# EAGLE design GadgetBox-Propeller (EAGLE 6.6.0)

## Sheet 1 of 2
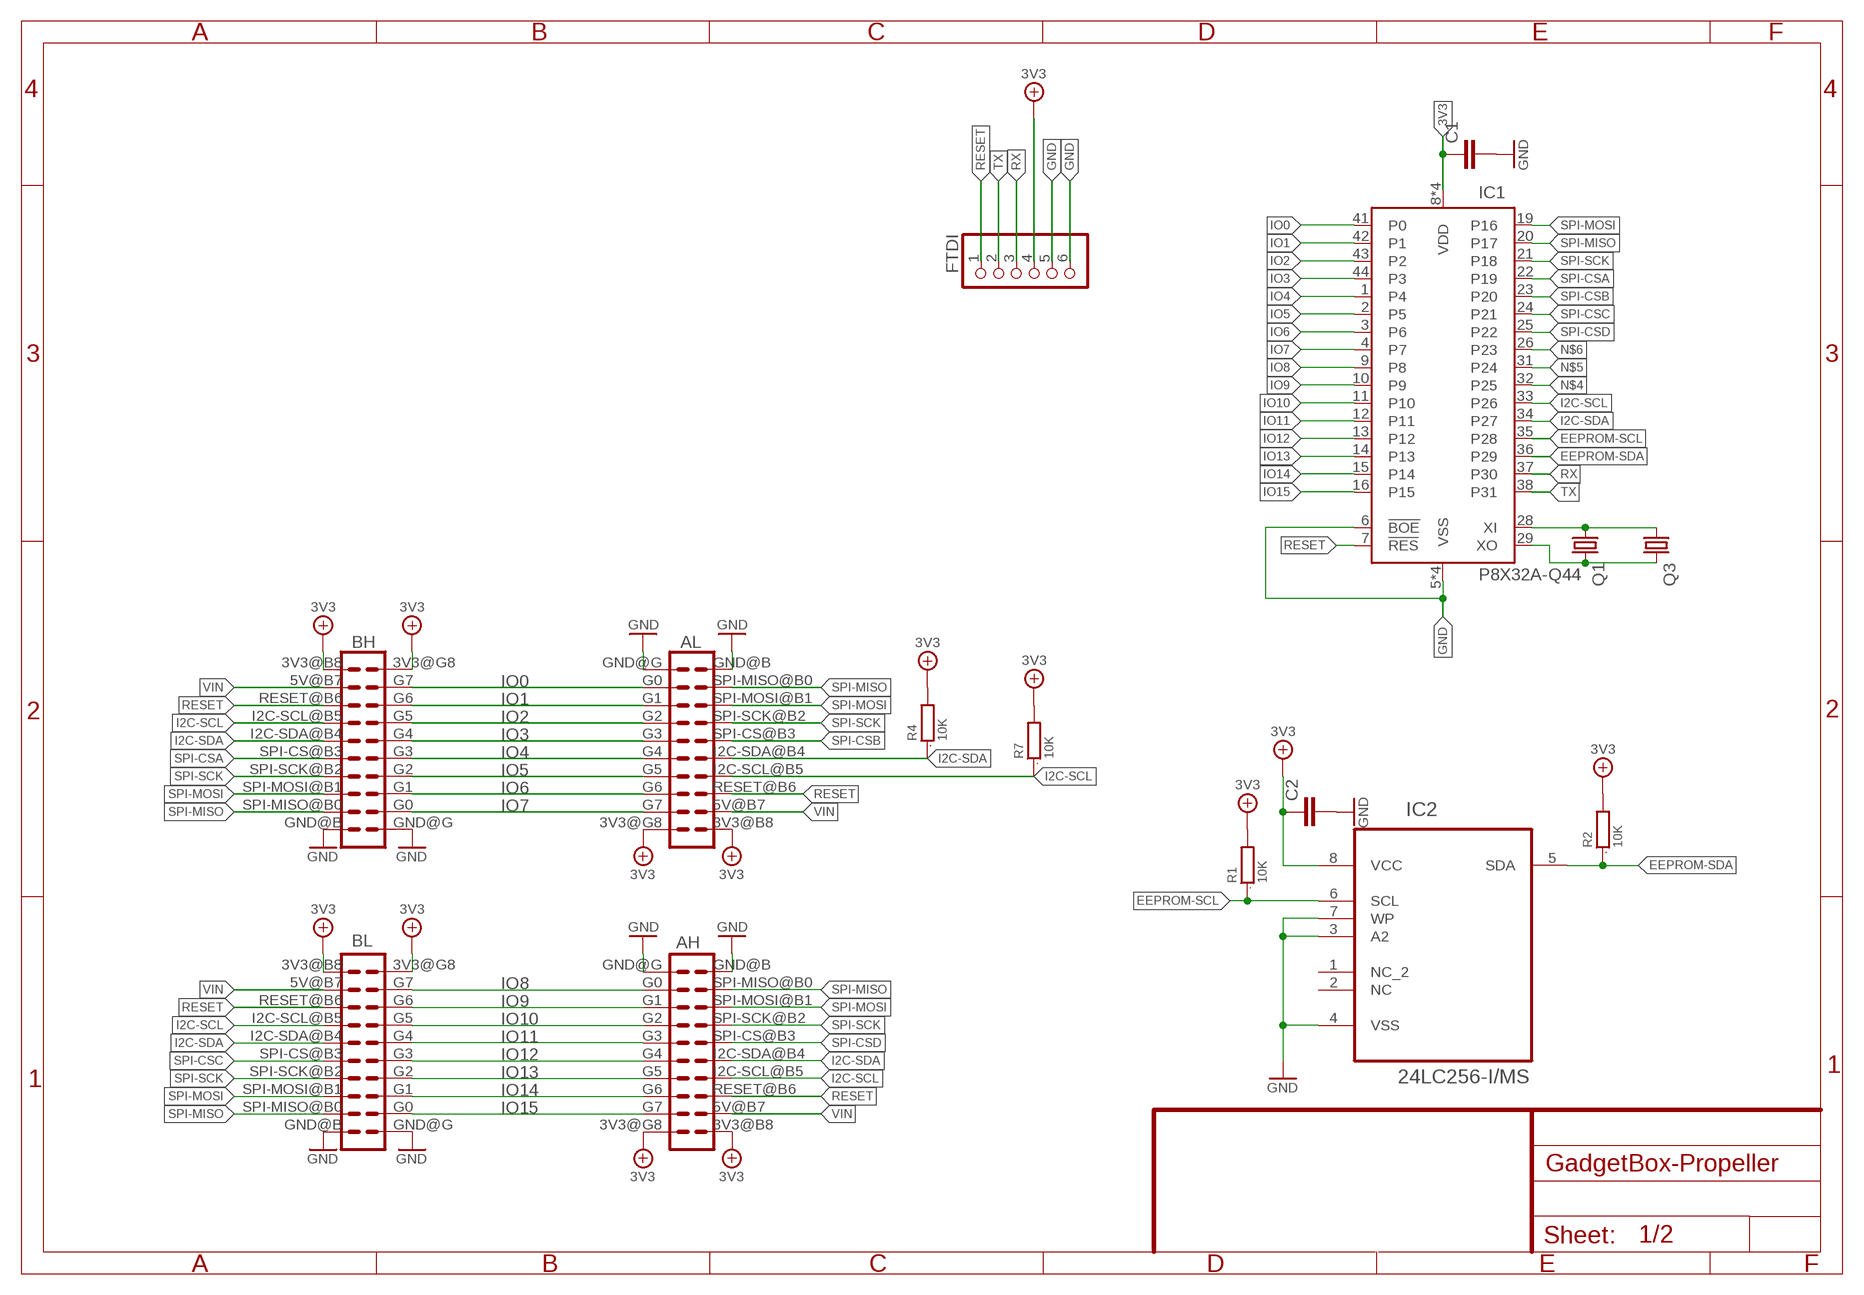
[diagram p0: schematic, sheet 1]

### Parts
AH  ECOGECOG_SLOT_ALT1  [ECOG_ALT1]
AL  ECOGECOG_SLOT_ALT1  [ECOG_ALT1]
BH  ECOGECOG_SLOT_ALT1  [ECOG_ALT1]
BL  ECOGECOG_SLOT_ALT1  [ECOG_ALT1]
C1  CAP0805  [0805]
C2  CAP0805  [0805]
FTDI  PINHD-1X6  [1X06]
IC1  P8X32A-Q44  [LQFP44-10X10]
IC2  24LC256-I/MS  [SOP65P490X110-8N]
Q1  CRYSTALSM49  [SM49]
Q3  CRYSTALHC49U-V  [HC49U-V]
R1  10K  R0603  [0603]
R2  10K  R0603  [0603]
R4  10K  R0603  [0603]
R7  10K  R0603  [0603]

### Nets
3V3: AH.3V3@B8(3V3) AH.3V3@G8(3V3) AL.3V3@B8(3V3) AL.3V3@G8(3V3) BH.3V3@B8(3V3) BH.3V3@G8(3V3) BL.3V3@B8(3V3) BL.3V3@G8(3V3) C1.1 C2.1 FTDI.4 IC1.8(VDD) IC1.18(VDD) IC1.30(VDD) IC1.40(VDD) IC2.8(VCC) R1.2 R2.2 R4.2 R7.2
EEPROM-SCL: IC1.35(P28) IC2.6(SCL) R1.1
EEPROM-SDA: IC1.36(P29) IC2.5(SDA) R2.1
GND [gnd]: AH.GND@B(GND) AH.GND@G(GND) AL.GND@B(GND) AL.GND@G(GND) BH.GND@B(GND) BH.GND@G(GND) BL.GND@B(GND) BL.GND@G(GND) C1.2 C2.2 FTDI.5 FTDI.6 IC1.5(VSS) IC1.6(!BOE) IC1.17(VSS) IC1.27(VSS) IC1.39(VSS) IC2.3(A2) IC2.4(VSS) IC2.7(WP) ; also sheet 2
I2C-SCL: AH.I2C-SCL@B5(I2C-SCL) AL.I2C-SCL@B5(I2C-SCL) BH.I2C-SCL@B5(I2C-SCL) BL.I2C-SCL@B5(I2C-SCL) IC1.33(P26) R7.1
I2C-SDA: AH.I2C-SDA@B4(I2C-SDA) AL.I2C-SDA@B4(I2C-SDA) BH.I2C-SDA@B4(I2C-SDA) BL.I2C-SDA@B4(I2C-SDA) IC1.34(P27) R4.1
IO0: AL.G0 BH.G7 IC1.41(P0)
IO1: AL.G1 BH.G6 IC1.42(P1)
IO2: AL.G2 BH.G5 IC1.43(P2)
IO3: AL.G3 BH.G4 IC1.44(P3)
IO4: AL.G4 BH.G3 IC1.1(P4)
IO5: AL.G5 BH.G2 IC1.2(P5)
IO6: AL.G6 BH.G1 IC1.3(P6)
IO7: AL.G7 BH.G0 IC1.4(P7)
IO8: AH.G0 BL.G7 IC1.9(P8)
IO9: AH.G1 BL.G6 IC1.10(P9)
IO10: AH.G2 BL.G5 IC1.11(P10)
IO11: AH.G3 BL.G4 IC1.12(P11)
IO12: AH.G4 BL.G3 IC1.13(P12)
IO13: AH.G5 BL.G2 IC1.14(P13)
IO14: AH.G6 BL.G1 IC1.15(P14)
IO15: AH.G7 BL.G0 IC1.16(P15)
N$2: IC1.28(XI) Q1.1 Q3.1
N$3: IC1.29(XO) Q1.2 Q3.2
N$4: IC1.32(P25)
N$5: IC1.31(P24)
N$6: IC1.26(P23)
RESET: AH.RESET@B6(RESET) AL.RESET@B6(RESET) BH.RESET@B6(RESET) BL.RESET@B6(RESET) FTDI.1 IC1.7(!RES)
RX: FTDI.3 IC1.37(P30)
SPI-CSA: BH.SPI-CS@B3(SPI-CS) IC1.22(P19)
SPI-CSB: AL.SPI-CS@B3(SPI-CS) IC1.23(P20)
SPI-CSC: BL.SPI-CS@B3(SPI-CS) IC1.24(P21)
SPI-CSD: AH.SPI-CS@B3(SPI-CS) IC1.25(P22)
SPI-MISO: AH.SPI-MISO@B0(SPI-MISO) AL.SPI-MISO@B0(SPI-MISO) BH.SPI-MISO@B0(SPI-MISO) BL.SPI-MISO@B0(SPI-MISO) IC1.20(P17)
SPI-MOSI: AH.SPI-MOSI@B1(SPI-MOSI) AL.SPI-MOSI@B1(SPI-MOSI) BH.SPI-MOSI@B1(SPI-MOSI) BL.SPI-MOSI@B1(SPI-MOSI) IC1.19(P16)
SPI-SCK: AH.SPI-SCK@B2(SPI-SCK) AL.SPI-SCK@B2(SPI-SCK) BH.SPI-SCK@B2(SPI-SCK) BL.SPI-SCK@B2(SPI-SCK) IC1.21(P18)
TX: FTDI.2 IC1.38(P31)
VIN: AH.5V@B7(5V) AL.5V@B7(5V) BH.5V@B7(5V) BL.5V@B7(5V) ; also sheet 2
Unconnected: IC2.1(NC_2) IC2.2(NC)

## Sheet 2 of 2
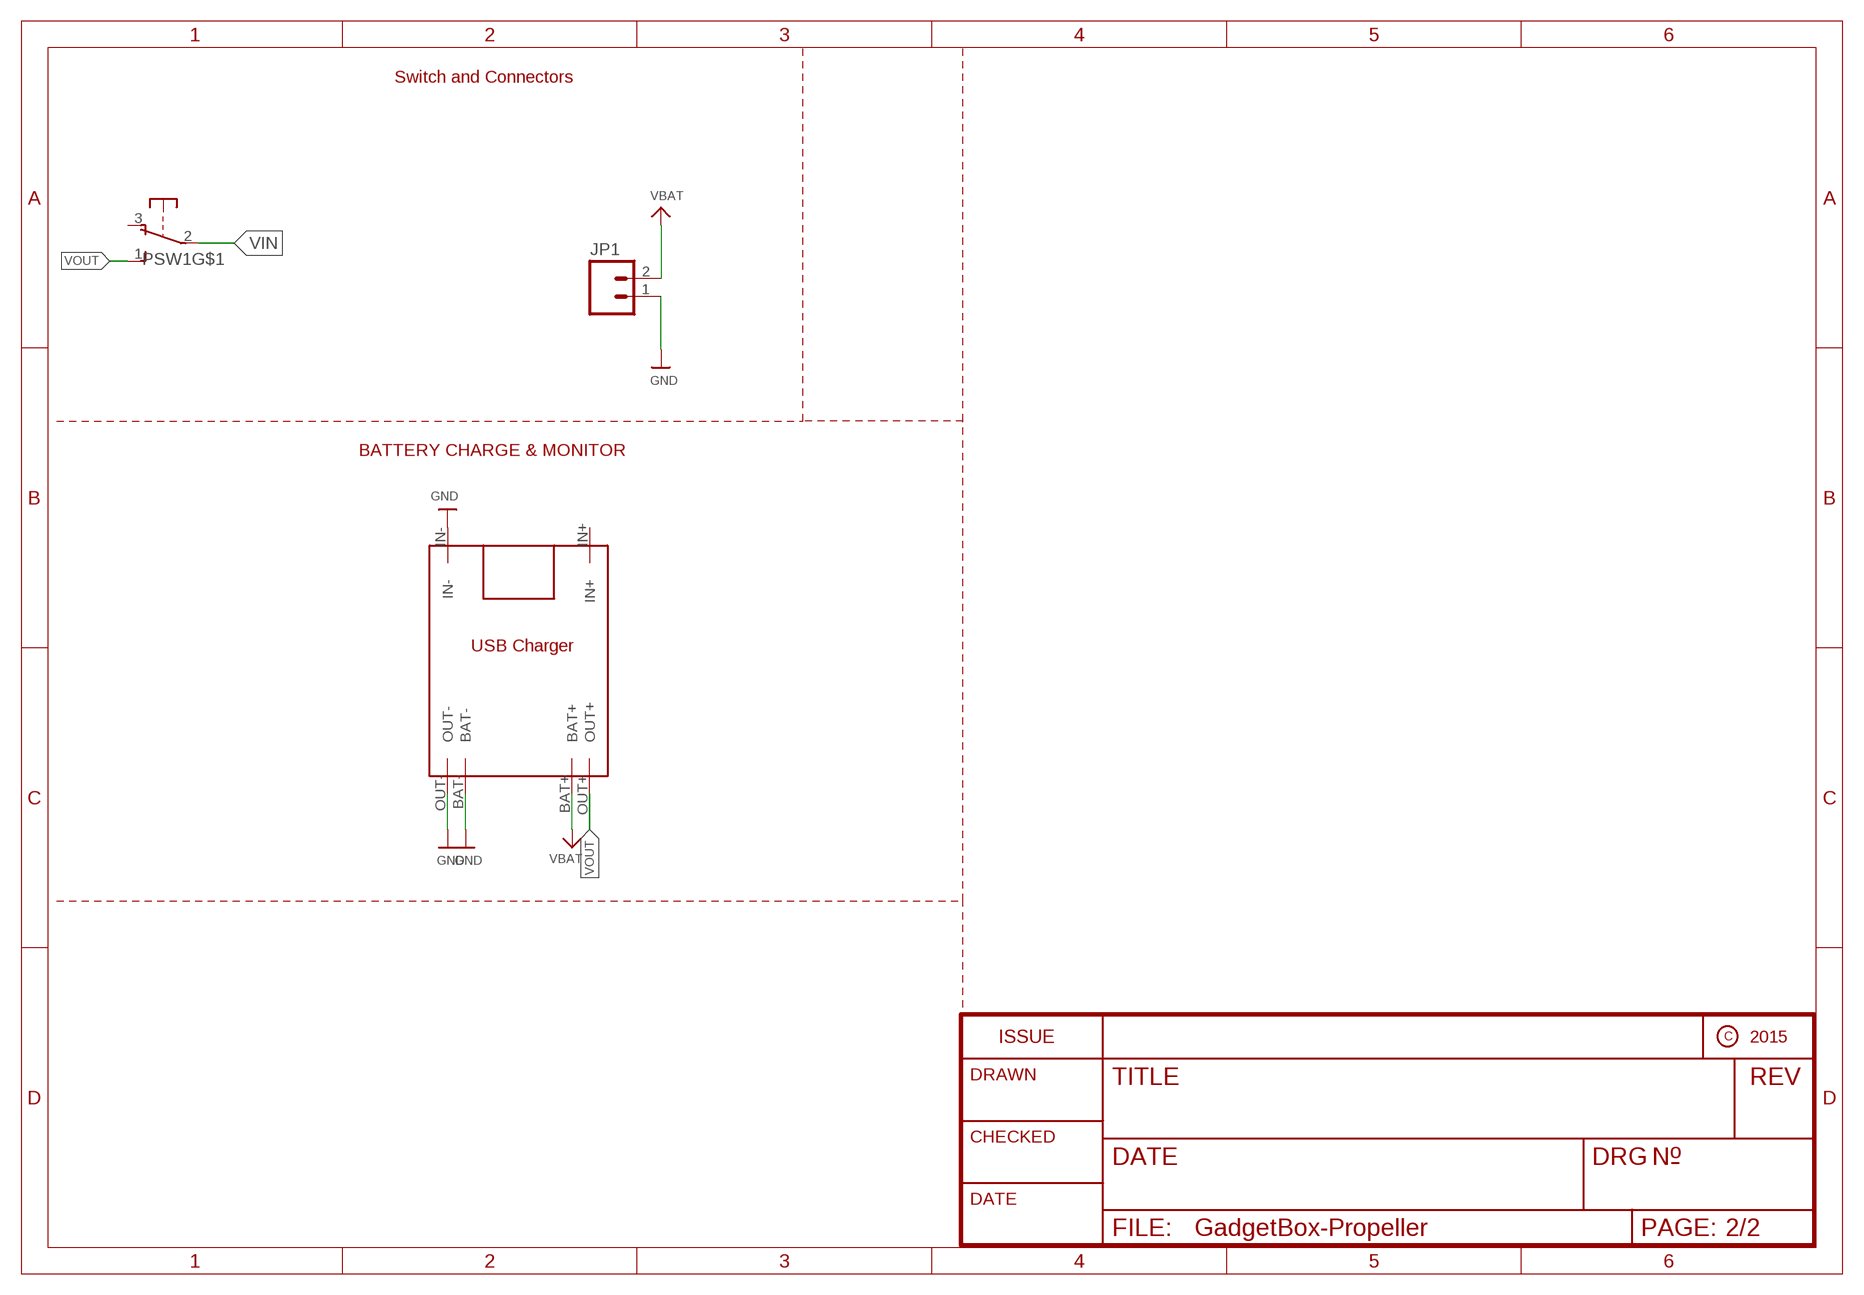
[diagram p1: schematic, sheet 2]

### Parts
JP1  M02-JST-2-PTH-NO_SILK  [JST-2-PTH-NS]
PSW1  OS102011MA1Q  [OS102011MA1Q]
U$5  TP4056  [TP4056]

### Nets
GND [gnd]: JP1.1 U$5.BAT- U$5.IN- U$5.OUT- ; also sheet 1
VBAT: JP1.2 U$5.BAT+
VIN: PSW1.2(P) ; also sheet 1
VOUT: PSW1.1(S) U$5.OUT+
Unconnected: PSW1.3(O) PSW1.MT1(MT) PSW1.MT2(MT) U$5.IN+

### Notes on the sheet
- Switch and Connectors
- BATTERY CHARGE & MONITOR

## Library data of the parts
AH AL BH BL = eCogs:ECOG; PARTNO: PPPC102LFBN-RC,SULLINS CONNECTOR SOLUTIONS,dk,S6106-ND,"CONN HEADER FEM 20POS.1"" DL GOLD", REF67
C1 C2 = SparkFun-Passives:CAP: Capacitor Standard 0603 ceramic capacitor, and 0.1" leaded capacitor.
FTDI = GadgetFactory:PINHD-1X6: PIN HEADER; PARTNO: PPPC061LGBN-RC,SULLINS CONNECTOR SOLUTIONS,dk,S5481-ND ,"6 Position Header Connector 0.100"" (2.54mm) Through Hole - Right Angle Gold ", REF91
IC1 = p8x32a_11:P8X32A-?: 8-Cog Multiprocessor Microcontroller Source: http://www.parallax.com/sites/default/files/downloads/P8X32A-Propeller-Datasheet-v1.4.0_0.pdf; MF: Parallax Semiconductor; MPN: P8X32A-Q44; OC_FARNELL: 1263887; OC_NEWARK: 11X5687
IC2 = Microchip_By_element14_Batch_1:24LC256-I/MS: 256K I2C CMOS Serial EEPROM; MPN: 24LC256-I/MS; OC_FARNELL: 1331329; OC_NEWARK: 54K2863; PACKAGE: MSOP-8; SUPPLIER: MICROCHIP
JP1 = SparkFun:M02: Header 2 Standard 2-pin 0.1" header. Use with straight break away headers (SKU : PRT-00116), right angle break away headers (PRT-00553), swiss pins (PRT-00743), machine pins (PRT-00117), and female headers (PRT-00115). Molex polarized connector foot print use with SKU : PRT-08233 with associated crimp pins and housings.; PARTNO: B2B-PH-SM4-TB(LF)(SN),JST SALES AMERICA INC (VA),dk,455-1734-1-ND ,"2 Positions Header, Shrouded Connector 0.079 (2.00mm) Through Hole Tin ", REF87
PSW1 = adafruit:OS102011MA1Q: OS10201MA1Q through-hole right angle switch http://www.ladyada.net/library/eagle; PARTNO: OS102011MA1QN1,C&K Components,dk,CKN9559-ND,SWITCH SLIDE SPDT 100MA 12V , REF72
Q1 = adafruit:CRYSTAL: CRYSTAL; OC_FARNELL: unknown; OC_NEWARK: unknown
Q3 = adafruit:CRYSTAL: CRYSTAL; OC_FARNELL: 1666969; OC_NEWARK: unknown
R1 R2 R4 R7 = GadgetFactory:R: RESISTOR, European symbol; PARTNO: RC0603JR-0710KL,YAGEO (VA),dk,311-10KGRCT-ND,RES SMD 10K OHM 5% 1/10W 0603 , REF36
U$5 = TP4056 charging module:TP4056

## Net classes
2 gnd: width 0.254 mm, drill 0.381 mm, clearance 0.254 mm
3 usbvcc: width 0.254 mm, drill 0.381 mm, clearance 0.254 mm
4 aref: width 0.254 mm, drill 0.381 mm, clearance 0.254 mm

## Board
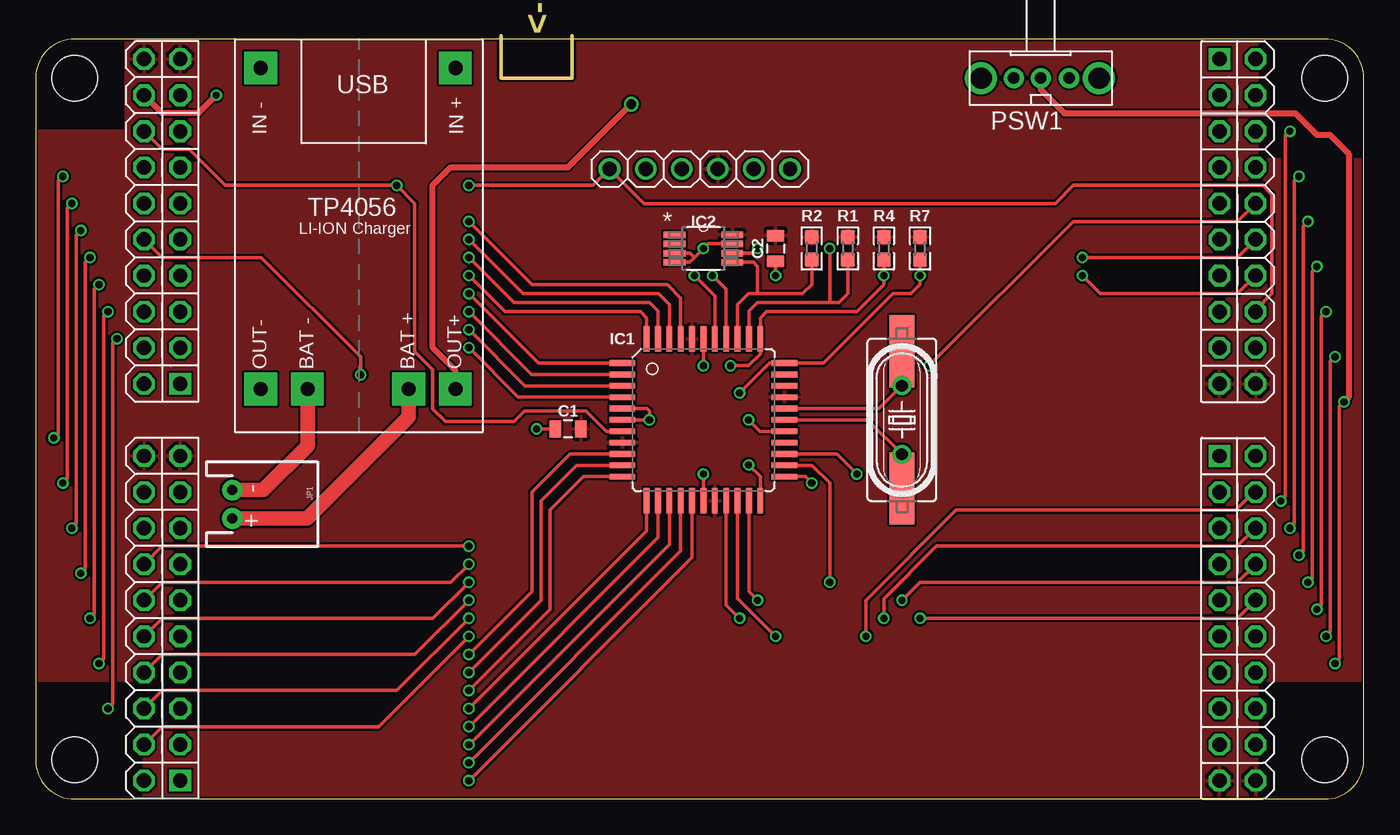
[diagram p2: board, top side]
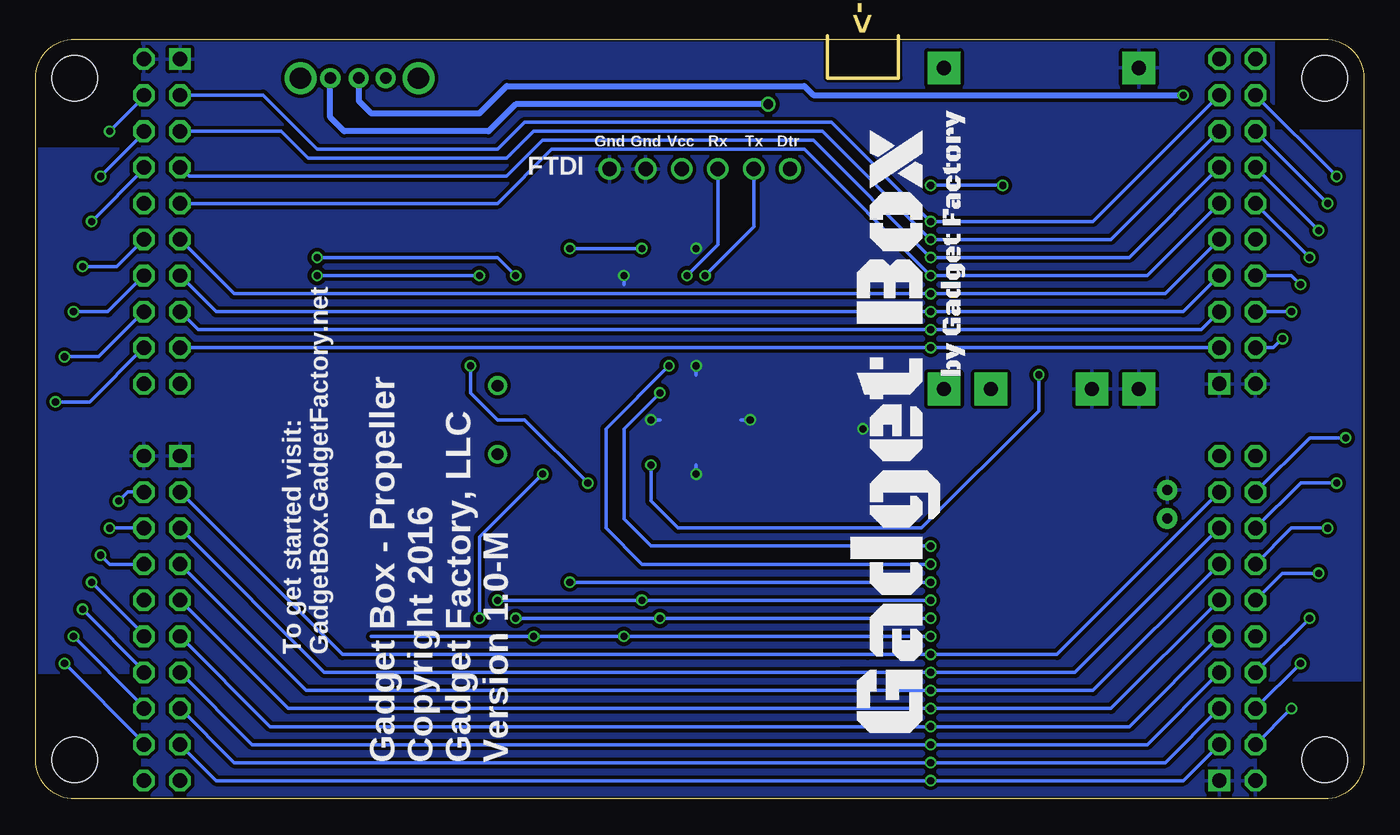
[diagram p3: board, bottom side, seen from below]

Size 93.5 x 53.75 mm. Coordinates in mm from the lower left corner, seen from the top.
Outline: 37.75,53.75 37.75,50.75 32.75,50.75 32.75,53.75
Copper layers (1*16): Top 0.035mm / dielectric 1.5mm / Bottom 0.035mm
Design rules "hackvana *": minimum track width 6mil, minimum drill 0.3mm, track to track 6mil, track to pad 6mil, pad to pad 6mil, via to via 6mil, smd to smd 0mil, copper to edge 6mil, drill to drill 6mil, minimum pad ring 10mil, minimum via ring 6mil, stop-mask expansion 2mil, vias tented up to drill 100mil, thermal gap 10mil

### Footprints (pad centres in the part's own frame; a part is rotated, then mirrored left to right if it is on the bottom)
ECOG93P53P5 = hole 3.2: 4,4; 92,4; 92,52; 4,52
ECOG_ALT1 = drill 1.016 octagon: 3V3@B8 21.59,3.81; 3V3@G8 21.59,1.27; 5V@B7 19.05,3.81; G0 1.27,1.27; G1 3.81,1.27; G2 6.35,1.27; G3 8.89,1.27; G4 11.43,1.27; G5 13.97,1.27; G6 16.51,1.27; G7 19.05,1.27; GND@B -1.27,3.81; I2C-SCL@B5 13.97,3.81; I2C-SDA@B4 11.43,3.81; RESET@B6 16.51,3.81; SPI-CS@B3 8.89,3.81; SPI-MISO@B0 1.27,3.81; SPI-MOSI@B1 3.81,3.81; SPI-SCK@B2 6.35,3.81 | drill 1.016 square: GND@G -1.27,1.27
0805 = smd 0.8 x 1.2: 1 -0.9,0; 2 0.9,0
1X06 = drill 1.016: 1 -6.35,0; 2 -3.81,0; 3 -1.27,0; 4 1.27,0; 5 3.81,0; 6 6.35,0
LQFP44-10X10 = smd 1.8 x 0.4: 1 -5.7,4; 2 -5.7,3.2; 3 -5.7,2.4; 4 -5.7,1.6; 5 -5.7,0.8; 6 -5.7,0; 7 -5.7,-0.8; 8 -5.7,-1.6; 9 -5.7,-2.4; 10 -5.7,-3.2; 11 -5.7,-4; 23 5.7,-4; 24 5.7,-3.2; 25 5.7,-2.4; 26 5.7,-1.6; 27 5.7,-0.8; 28 5.7,0; 29 5.7,0.8; 30 5.7,1.6; 31 5.7,2.4; 32 5.7,3.2; 33 5.7,4 | smd 0.4 x 1.8: 12 -4,-5.7; 13 -3.2,-5.7; 14 -2.4,-5.7; 15 -1.6,-5.7; 16 -0.8,-5.7; 17 0,-5.7; 18 0.8,-5.7; 19 1.6,-5.7; 20 2.4,-5.7; 21 3.2,-5.7; 22 4,-5.7; 34 4,5.7; 35 3.2,5.7; 36 2.4,5.7; 37 1.6,5.7; 38 0.8,5.7; 39 0,5.7; 40 -0.8,5.7; 41 -1.6,5.7; 42 -2.4,5.7; 43 -3.2,5.7; 44 -4,5.7
SOP65P490X110-8N = smd 1.524 x 0.457: 1 -2.032,0.965; 2 -2.032,0.33; 3 -2.032,-0.33; 4 -2.032,-0.965; 5 2.032,-0.965; 6 2.032,-0.33; 7 2.032,0.33; 8 2.032,0.965
JST-2-PTH-NS = drill 0.7 pad 1.448: 1 -1,0; 2 1,0
OS102011MA1Q = drill 0.8 pad 1.422: 1 -2,0; 2 0,0; 3 1.9,0 | drill 1.5 pad 2.184: MT1 -4.1,0; MT2 4.2,0
SM49 = smd 5.08 x 1.778: 1 -4.826,0; 2 4.826,0
HC49U-V = drill 0.813: 1 -2.413,0; 2 2.413,0
0603 = smd 1 x 1: 1 -0.8,0; 2 0.8,0
TP4056 = drill 1 pad 2.3 square: BAT+ 3.505,-8.89; BAT- -3.607,-8.89; IN+ 6.807,13.716; IN- -6.909,13.716; OUT+ 6.807,-8.89; OUT- -6.909,-8.89

### Placement (x,y rotation side)
$$U$1  [ECOG93P53P5]  -1.25,-1.25 0 top
AH  82.06,22.88 270 top
AL  82.06,50.82 270 top
BH  11.45,30.5 90 top
BL  11.45,2.56 90 top
C1  37.48,26.05 180 top
C2  52.09,38.76 270 top
FTDI  46.75,44.35 0 top
IC1  47.01,26.69 0 top
IC2  47.01,38.76 0 top
JP1  13.85,20.75 270 top
PSW1  70.75,50.75 180 top
Q1  60.98,26.69 90 top
Q3  60.98,26.69 90 top
R1  57.17,38.76 90 top
R2  54.63,38.76 90 top
R4  59.71,38.76 90 top
R7  62.25,38.76 90 top
U$5  22.75,37.75 0 top
U$100  [GADGETBOX_TEXT]  32.79,25.93 90 bottom

### Tracks (layer width: path | path; a pad name or v marks a point on that pad's centre or on a via)
3V3
  pour Top: -1.25,8.37 -1.25,47.03 6.37,47.03 6.37,54.63 85.95,54.63 85.95,45.01 94.92,45.01 94.92,8.37 85.95,8.37 85.95,-1.25 7.64,-1.25 7.64,8.37
EEPROM-SCL  (via drill 0.5)
  Top 0.254: IC1.35 50.21,34.34 50.82,34.95 55.9,34.95 | 55.9,34.95 56.53,34.95 57.17,35.58 R1.1 | IC2.6 50.52,38.42 v50.82,38.76 | v55.9,38.76 55.9,34.95
  Bottom 0.254: v50.82,38.76 v55.9,38.76
EEPROM-SDA
  Top 0.254: IC1.36 49.41,34.8 50.19,35.58 50.82,35.58 | 50.82,35.58 53.99,35.58 54.63,36.22 R2.1 | IC2.5 50.52,37.79 50.82,37.48 50.82,35.58
GND  (via drill 0.5)
  Top 0.254: IC1.39 v47.01,30.5 | IC1.6 v43.2,26.69 43.2,27.32 43.03,27.49 IC1.5 | IC1.27 50.98,25.89 v50.19,26.69 | IC1.17 v47.01,22.88 | IC2.4 46.05,37.79 46.38,38.12 | 46.38,38.12 v47.01,38.76 47.34,39.09 IC2.7 | IC2.3 46.07,38.42 46.38,38.12 | C2.2 v52.09,36.85 | C1.2 v35.26,26.05
  Top 1.016: JP1.1 16.04,21.75 19.14,24.86 U$5.BAT-
  Bottom 0.254: v47.01,30.5 47.01,29.86 | v43.2,26.69 43.84,26.69 | v50.19,26.69 49.55,26.69 | v47.01,22.88 47.01,23.52 | v52.09,36.85 52.09,36.22 | v35.26,26.05 34.95,26.05
  pour Bottom: -1.25,8.4 -1.25,47.01 6.37,47.01 6.37,55.14 85.95,55.14 85.95,45.74 94.92,45.74 94.92,8.91 85.95,8.91 85.95,-1.12 7.64,-1.12 7.64,8.4
I2C-SCL  (via drill 0.5)
  Top 0.254: BL.I2C-SCL@B5 8.91,17.8 v30.5,17.8 | v49.55,28.59 51.65,30.69 IC1.33 55.45,30.69 60.34,35.58 61.62,35.58 62.25,36.22 v62.25,36.85 R7.1 | v3.2,40.02 2.88,39.71 2.88,19.39 v2.56,19.07 | v90.19,13.36 90.51,13.67 90.51,33.99 v90.83,34.31 | AL.I2C-SCL@B5 84.6,35.58 74.95,35.58 v73.68,36.85
  Bottom 0.254: v30.5,17.8 50.19,17.8 52.09,19.7 52.09,26.05 v49.55,28.59 | BH.I2C-SCL@B5 v3.2,40.02 | v2.56,19.07 5.1,19.07 BL.I2C-SCL@B5 | AH.I2C-SCL@B5 85.87,9.04 v90.19,13.36 | AL.I2C-SCL@B5 88.41,34.31 v90.83,34.31 | v62.25,36.85 v73.68,36.85
I2C-SDA  (via drill 0.5)
  Top 0.254: BL.I2C-SDA@B4 8.91,15.26 29.23,15.26 v30.5,16.53 | v48.91,30.5 50.19,30.5 51.01,31.33 IC1.34 51.01,33.87 51.45,34.31 57.8,34.31 59.71,36.22 v59.71,36.85 R4.1 | v3.83,38.12 3.51,37.8 3.51,16.21 v3.2,15.89 | v89.56,15.26 89.87,15.58 89.87,37.17 v90.19,37.48 | AL.I2C-SDA@B4 84.6,38.12 v73.68,38.12
  Bottom 0.254: v30.5,16.53 50.82,16.53 53.36,19.07 53.36,26.05 v48.91,30.5 | BH.I2C-SDA@B4 v3.83,38.12 | v3.2,15.89 5.74,15.89 BL.I2C-SDA@B4 | AH.I2C-SDA@B4 85.87,11.58 v89.56,15.26 | AL.I2C-SDA@B4 87.78,37.48 v90.19,37.48 | v59.71,36.85 60.98,38.12 v73.68,38.12
IO0  (via drill 0.5)
  Top 0.254: IC1.41 45.41,35.27 44.47,36.22 34.95,36.22 v30.5,40.66
  Bottom 0.254: BH.G7 19.07,40.66 v30.5,40.66 37.48,47.65 59.08,47.65 60.98,45.74 73.68,45.74 77.49,49.55 AL.G0
IO1  (via drill 0.5)
  Top 0.254: IC1.42 44.61,34.8 43.84,35.58 34.31,35.58 v30.5,39.39
  Bottom 0.254: BH.G6 17.8,39.39 v30.5,39.39 38.12,47.01 58.44,47.01 60.34,45.1 74.31,45.1 76.22,47.01 AL.G1
IO2  (via drill 0.5)
  Top 0.254: IC1.43 43.81,34.34 43.2,34.95 33.67,34.95 v30.5,38.12
  Bottom 0.254: BH.G5 16.53,38.12 v30.5,38.12 38.76,46.38 57.8,46.38 60.34,43.84 82.7,43.84 AL.G2
IO3  (via drill 0.5)
  Top 0.254: IC1.44 43.01,33.87 42.56,34.31 33.04,34.31 v30.5,36.85
  Bottom 0.254: BH.G4 15.26,36.85 v30.5,36.85 39.39,45.74 57.17,45.74 60.98,41.93 AL.G3
IO4  (via drill 0.5)
  Top 0.254: IC1.1 35.39,30.69 v30.5,35.58
  Bottom 0.254: BH.G3 13.99,35.58 v30.5,35.58 79.52,35.58 AL.G4
IO5  (via drill 0.5)
  Top 0.254: IC1.2 34.92,29.89 v30.5,34.31
  Bottom 0.254: BH.G2 12.72,34.31 v30.5,34.31 80.79,34.31 AL.G5
IO6  (via drill 0.5)
  Top 0.254: IC1.3 34.45,29.09 v30.5,33.04
  Bottom 0.254: AL.G6 82.06,33.04 v30.5,33.04 | v30.5,33.04 11.45,33.04 BH.G1 | v30.5,33.04 31.13,33.04
IO7  (via drill 0.5)
  Top 0.254: IC1.4 33.98,28.29 v30.5,31.77
  Bottom 0.254: BH.G0 v30.5,31.77 AL.G7
IO8  (via drill 0.5)
  Top 0.254: IC1.9 37.62,24.29 34.95,21.61 34.95,14.62 v30.5,10.18
  Bottom 0.254: BL.G7 21.61,10.18 v30.5,10.18 | v30.5,10.18 71.9,10.18 AH.G0 | v30.5,10.18 34.95,10.18
IO9  (via drill 0.5)
  Top 0.254: IC1.10 38.09,23.49 35.58,20.98 35.58,13.99 v30.5,8.91
  Bottom 0.254: BL.G6 20.34,8.91 v30.5,8.91 | AH.G1 73.17,8.91 v30.5,8.91 | v30.5,8.91 36.85,8.91
IO10  (via drill 0.5)
  Top 0.254: IC1.11 38.56,22.69 36.22,20.34 36.22,13.36 v30.5,7.64
  Bottom 0.254: BL.G5 19.07,7.64 v30.5,7.64 74.44,7.64 AH.G2
IO11  (via drill 0.5)
  Top 0.254: IC1.12 43.01,18.88 v30.5,6.37
  Bottom 0.254: BL.G4 17.8,6.37 v30.5,6.37 75.71,6.37 AH.G3
IO12  (via drill 0.5)
  Top 0.254: IC1.13 43.81,18.41 v30.5,5.1
  Bottom 0.254: BL.G3 16.53,5.1 v30.5,5.1 | AH.G4 76.98,5.1 v30.5,5.1 | v30.5,5.1 43.84,5.1
IO13  (via drill 0.5)
  Top 0.254: IC1.14 44.61,17.94 v30.5,3.83
  Bottom 0.254: BL.G2 15.26,3.83 v30.5,3.83 78.25,3.83 AH.G5
IO14  (via drill 0.5)
  Top 0.254: IC1.15 45.41,17.47 v30.5,2.56
  Bottom 0.254: BL.G1 13.99,2.56 v30.5,2.56 79.52,2.56 AH.G6
IO15  (via drill 0.5)
  Top 0.254: IC1.16 46.21,17 v30.5,1.29
  Bottom 0.254: BL.G0 12.72,1.29 v30.5,1.29 80.79,1.29 AH.G7
N$2
  Top 0.254: IC1.28 58.57,26.69 Q3.1 Q1.1
N$3
  Top 0.254: IC1.29 59.37,27.49 Q3.2 Q1.2 60.98,31.77
RESET  (via drill 0.5)
  Top 0.254: v2.56,41.93 2.24,41.61 2.24,22.56 v1.92,22.25 | v90.83,11.45 91.14,11.77 91.14,30.82 v91.46,31.13 | IC1.7 40.19,25.89 38.76,27.32 34.44,27.32 33.67,26.56 28.85,26.56 27.96,27.45 27.96,30.25 26.69,31.52 26.69,33.67 26.69,34.18 26.69,41.93 v25.42,43.2 13.36,43.2 10.81,45.74 8.91,45.74 BH.RESET@B6 | v30.5,43.2 39.25,43.2 FTDI.1 42.82,41.93 71.78,41.93 73.05,43.2 86.38,43.2 87.02,42.56 87.02,35.58 85.87,34.44 AL.RESET@B6
  Bottom 0.254: BH.RESET@B6 v2.56,41.93 | BL.RESET@B6 4.46,22.25 v1.92,22.25 | AH.RESET@B6 85.87,6.5 v90.83,11.45 | AL.RESET@B6 89.05,31.13 v91.46,31.13 | v25.42,43.2 v30.5,43.2
RX  (via drill 0.5)
  Top 0.254: IC1.37 48.61,35.88 v47.65,36.85
  Bottom 0.254: FTDI.3 45.48,39.02 v47.65,36.85
SPI-CSA  (via drill 0.5)
  Top 0.254: BH.SPI-CS@B3 8.91,38.12 15.89,38.12 22.88,31.13 v22.88,29.86 | IC1.22 51.01,22.69 v50.19,23.52
  Bottom 0.254: v22.88,29.86 22.88,27.32 31.13,19.07 48.28,19.07 50.19,20.98 v50.19,23.52
SPI-CSB  (via drill 0.5)
  Top 0.254: IC1.23 54.19,22.69 v54.63,22.25 | v62.89,30.5 73.05,40.66 84.6,40.66 AL.SPI-CS@B3
  Bottom 0.254: v62.89,30.5 62.89,28.59 60.98,26.69 59.08,26.69 v54.63,22.25
SPI-CSC  (via drill 0.5)
  Top 0.254: BL.SPI-CS@B3 8.91,12.72 27.96,12.72 v30.5,15.26 | IC1.24 54.66,23.49 55.9,22.25 v55.9,15.26
  Bottom 0.254: v30.5,15.26 v55.9,15.26
SPI-CSD  (via drill 0.5)
  Top 0.254: AH.SPI-CS@B3 84.6,12.72 v62.25,12.72 | v57.8,22.88 56.4,24.29 IC1.25
  Bottom 0.254: v62.25,12.72 62.25,18.43 v57.8,22.88
SPI-MISO  (via drill 0.5)
  Top 0.254: BL.SPI-MISO@B0 8.91,5.1 24.15,5.1 v30.5,11.45 | AH.SPI-MISO@B0 85.75,21.61 84.47,20.34 64.79,20.34 58.44,13.99 v58.44,11.45 | v5.74,32.41 5.42,32.09 5.42,6.69 v5.1,6.37 | IC1.20 49.41,14.13 v52.09,11.45 | v87.65,20.98 87.97,21.29 87.97,46.69 v88.28,47.01
  Bottom 0.254: v30.5,11.45 v52.09,11.45 v58.44,11.45 69.87,11.45 | BH.SPI-MISO@B0 6.37,31.77 v5.74,32.41 | v5.1,6.37 BL.SPI-MISO@B0 | AL.SPI-MISO@B0 85.87,49.42 v88.28,47.01 | AH.SPI-MISO@B0 87.02,21.61 v87.65,20.98
SPI-MOSI  (via drill 0.5)
  Top 0.254: BL.SPI-MOSI@B1 8.91,7.64 25.42,7.64 v30.5,12.72 | AH.SPI-MOSI@B1 84.6,17.8 63.41,17.8 59.71,14.1 v59.71,12.72 | v5.1,34.31 4.78,33.99 4.78,9.86 v4.46,9.54 | IC1.19 48.61,13.66 v49.55,12.72 | v88.28,19.07 88.6,19.39 88.6,43.52 v88.92,43.84
  Bottom 0.254: v30.5,12.72 v49.55,12.72 v59.71,12.72 | BH.SPI-MOSI@B1 v5.1,34.31 | v4.46,9.54 BL.SPI-MOSI@B1 | AH.SPI-MOSI@B1 v88.28,19.07 | AL.SPI-MOSI@B1 85.87,46.88 v88.92,43.84
SPI-SCK  (via drill 0.5)
  Top 0.254: BL.SPI-SCK@B2 8.91,10.18 26.69,10.18 v30.5,13.99 | AH.SPI-SCK@B2 84.6,15.26 62.25,15.26 v60.98,13.99 | v4.46,36.22 4.15,35.9 4.15,13.04 v3.83,12.72 | IC1.21 50.21,14.6 v50.82,13.99 | v88.92,17.16 89.24,17.48 89.24,40.34 v89.56,40.66
  Bottom 0.254: v60.98,13.99 v50.82,13.99 v30.5,13.99 | BH.SPI-SCK@B2 5.1,36.85 v4.46,36.22 | v3.83,12.72 BL.SPI-SCK@B2 | AH.SPI-SCK@B2 88.28,16.53 v88.92,17.16 | AL.SPI-SCK@B2 85.87,44.34 v89.56,40.66
TX  (via drill 0.5)
  Top 0.254: IC1.38 47.81,35.41 v46.38,36.85
  Bottom 0.254: v46.38,36.85 42.94,40.28 FTDI.2
VBAT
  Top 1.016: U$5.BAT+ 26.25,26.89 19.11,19.75 JP1.2
VIN  (via drill 0.5)
  Top 0.254: v1.92,43.84 1.61,43.52 1.61,25.74 v1.29,25.42 | v91.46,9.54 91.78,9.86 91.78,27.64 v92.09,27.96
  Top 0.406: PSW1.2 70.75,49.94 72.41,48.28 88.67,48.28 90.19,46.76 91.08,46.76 92.41,45.42 92.41,28.28 v92.09,27.96 | v12.72,49.55 11.45,48.28 8.91,48.28 BH.5V@B7
  Bottom 0.254: BH.5V@B7 v1.92,43.84 | BL.5V@B7 3.83,25.42 v1.29,25.42 | AH.5V@B7 85.87,3.96 v91.46,9.54 | AL.5V@B7 89.68,27.96 v92.09,27.96
  Bottom 0.406: PSW1.2 70.75,49.16 69.87,48.28 62.25,48.28 60.34,50.19 39.39,50.19 38.76,49.55 v12.72,49.55
VOUT  (via drill 0.7)
  Top 0.406: U$5.OUT+ 29.56,30.17 27.96,31.77 27.96,43.2 29.23,44.47 37.48,44.47 v41.93,48.91
  Bottom 0.406: v41.93,48.91 59.71,48.91 61.62,47.01 71.78,47.01 72.75,47.98 PSW1.1

### Text on the board
Dimension: <---Cutout
bPlace: Dtr | Tx | Rx | Vcc | Gnd | Gnd | To get started visit: / GadgetBox.GadgetFactory.net | Gadget Box - Propeller / Copyright 2016 / Gadget Factory, LLC / Version 1.0-M
Reference: TOP Silkscreen is on layer 200